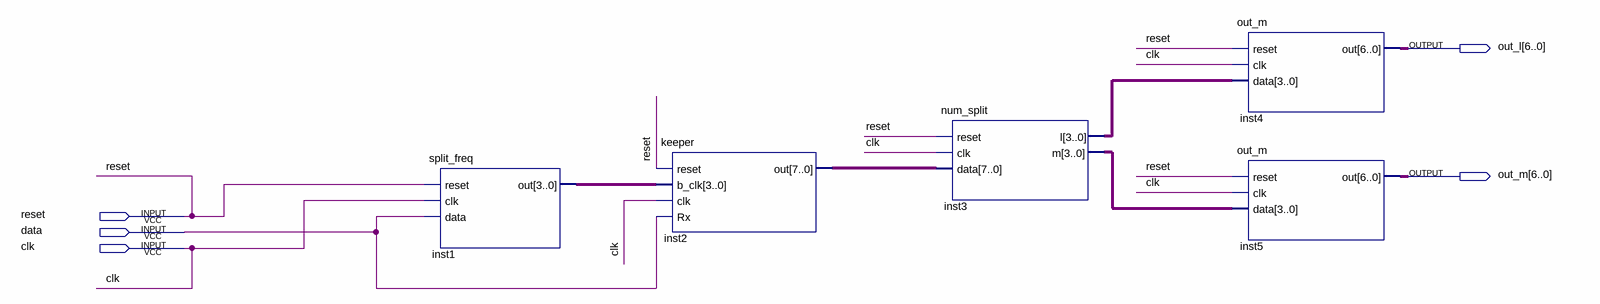
[diagram p0: schematic sheet]
// Quartus schematic block.bdf as structural Verilog: 5 symbols, 5 pins
module block (
  input  reset,
  input  data,
  input  clk,
  output [6:0] out_l,
  output [6:0] out_m
);

  wire [3:0] inst1_out, inst3_l, inst3_m;
  wire [7:0] inst2_out;

  split_freq inst1 (.reset(reset), .clk(clk), .data(data), .out(inst1_out));
  keeper inst2 (.reset(reset), .b_clk(inst1_out), .clk(clk), .Rx(data), .out(inst2_out));
  num_split inst3 (.reset(reset), .clk(clk), .data(inst2_out), .l(inst3_l), .m(inst3_m));
  out_m inst4 (.reset(reset), .clk(clk), .data(inst3_l), .out(out_l));
  out_m inst5 (.reset(reset), .clk(clk), .data(inst3_m), .out(out_m));
endmodule
